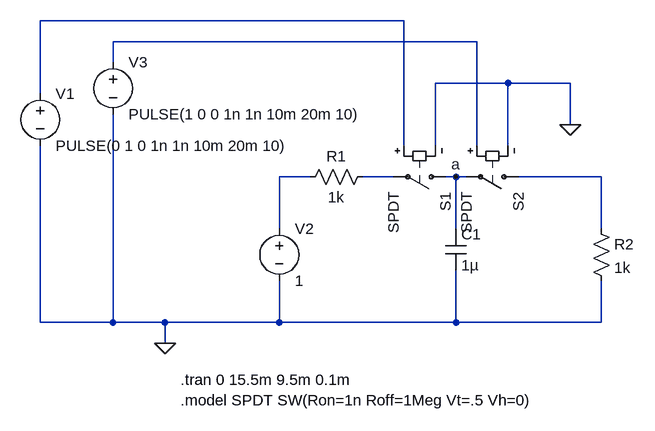
[diagram p0: schematic RC_natural.asc]
RC_natural.asc, the LTspice schematic file:
Version 4
SHEET 1 880 680
WIRE 96 -96 -464 -96
WIRE 208 -64 -352 -64
WIRE -352 -32 -352 -64
WIRE 256 0 144 0
WIRE 352 0 256 0
WIRE -464 16 -464 -96
WIRE 352 64 352 0
WIRE 96 96 96 -96
WIRE 144 96 144 0
WIRE 208 96 208 -64
WIRE 256 96 256 0
WIRE -48 144 -96 144
WIRE 80 144 32 144
WIRE 176 144 160 144
WIRE 192 144 176 144
WIRE 400 144 272 144
WIRE -96 224 -96 144
WIRE 176 224 176 144
WIRE 400 224 400 144
WIRE -464 368 -464 96
WIRE -352 368 -352 48
WIRE -352 368 -464 368
WIRE -272 368 -352 368
WIRE -96 368 -96 304
WIRE -96 368 -272 368
WIRE 176 368 176 288
WIRE 176 368 -96 368
WIRE 400 368 400 304
WIRE 400 368 176 368
WIRE -272 400 -272 368
FLAG -272 400 0
FLAG 352 64 0
FLAG 176 144 a
SYMBOL sw 176 144 R90
SYMATTR InstName S1
SYMATTR Value SPDT
SYMBOL sw 288 144 R90
SYMATTR InstName S2
SYMATTR Value SPDT
SYMBOL cap 160 224 R0
SYMATTR InstName C1
SYMATTR Value 1µ
SYMBOL voltage -464 0 R0
WINDOW 123 0 0 Left 0
WINDOW 39 0 0 Left 0
SYMATTR InstName V1
SYMATTR Value PULSE(0 1 0 1n 1n 10m 20m 10)
SYMBOL voltage -96 208 R0
WINDOW 123 0 0 Left 0
WINDOW 39 0 0 Left 0
SYMATTR InstName V2
SYMATTR Value 1
SYMBOL res 48 128 R90
WINDOW 0 0 56 VBottom 2
WINDOW 3 32 56 VTop 2
SYMATTR InstName R1
SYMATTR Value 1k
SYMBOL res 384 208 R0
SYMATTR InstName R2
SYMATTR Value 1k
SYMBOL voltage -352 -48 R0
WINDOW 123 0 0 Left 0
WINDOW 39 0 0 Left 0
SYMATTR InstName V3
SYMATTR Value PULSE(1 0 0 1n 1n 10m 20m 10)
TEXT -248 456 Left 2 !.tran 0 15.5m 9.5m 0.1m
TEXT -248 488 Left 2 !.model SPDT SW(Ron=1n Roff=1Meg Vt=.5 Vh=0)

The netlist it stands for:
* RC_natural.asc
S1 a N004 N001 0 SPDT
S2 N005 a N002 0 SPDT
C1 a 0 1µ
V1 N001 0 PULSE(0 1 0 1n 1n 10m 20m 10)
V2 N003 0 1
R1 N004 N003 1k
R2 N005 0 1k
V3 N002 0 PULSE(1 0 0 1n 1n 10m 20m 10)
.tran 0 15.5m 9.5m 0.1m
.model SPDT SW(Ron=1n Roff=1Meg Vt=.5 Vh=0)
.backanno
.end